# EAGLE design CrackberryPi_1.0.5_test3 (EAGLE 7.2.0)
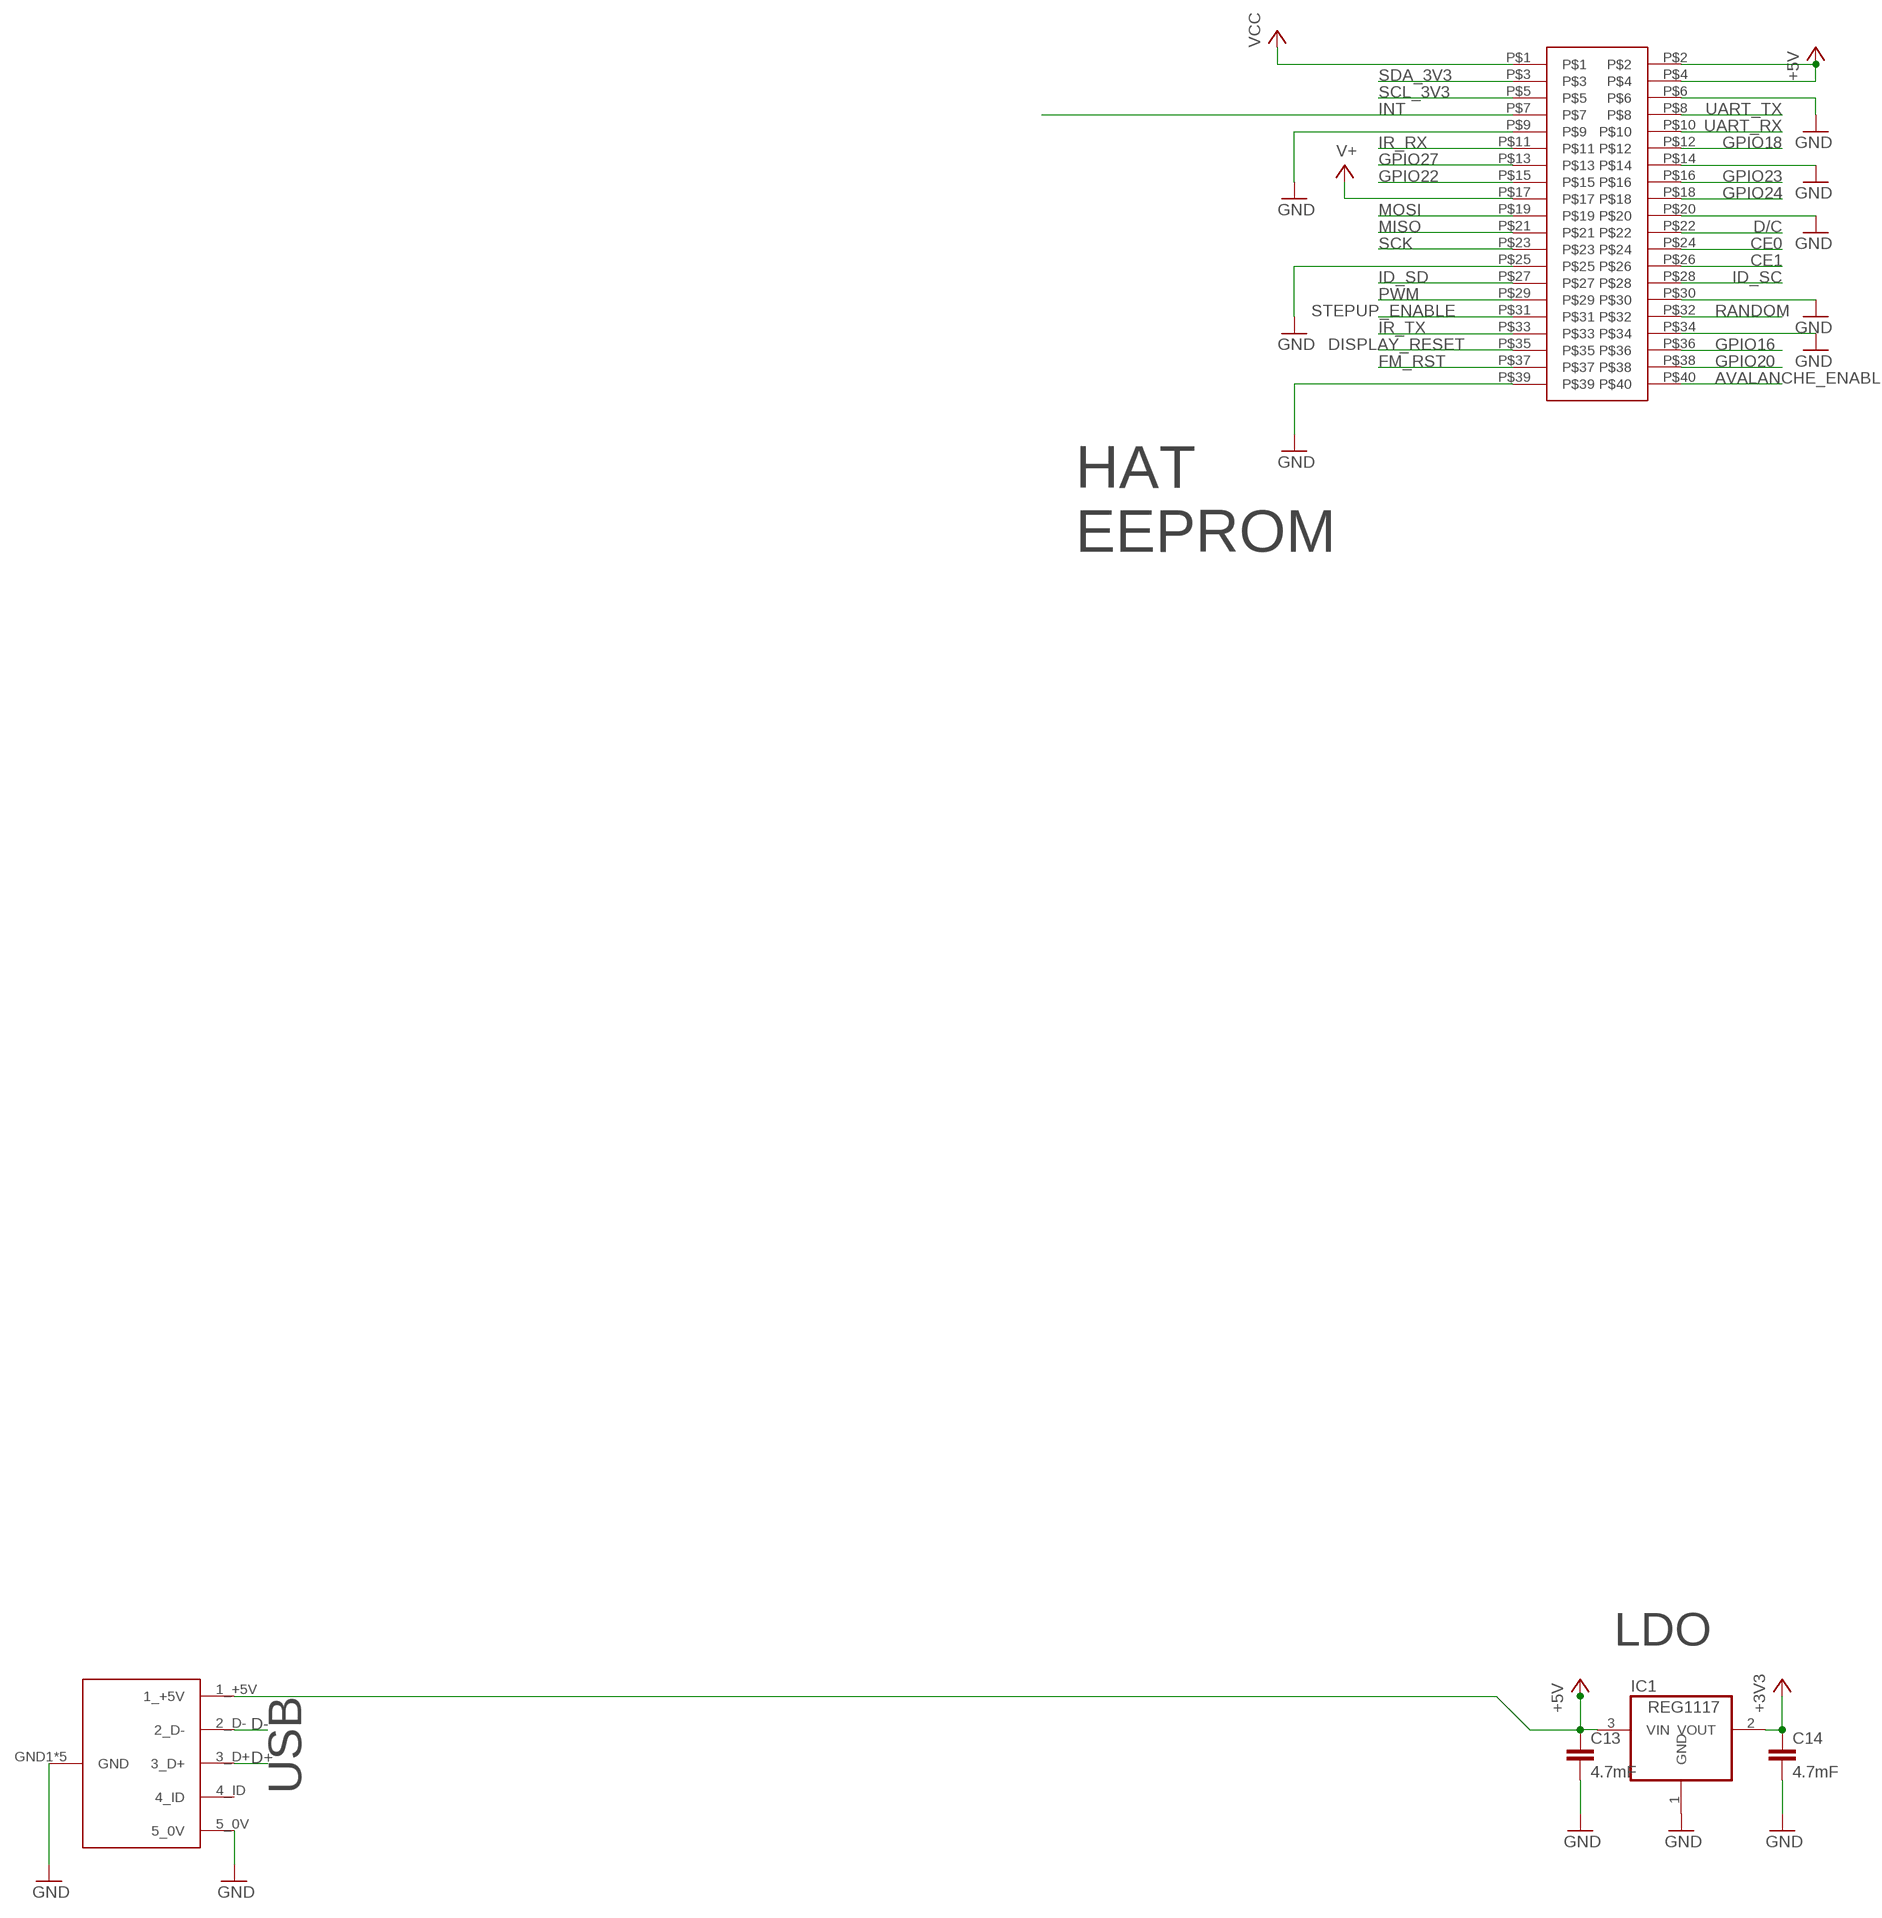
[diagram p0: schematic, sheet 1, part 1 of 2]
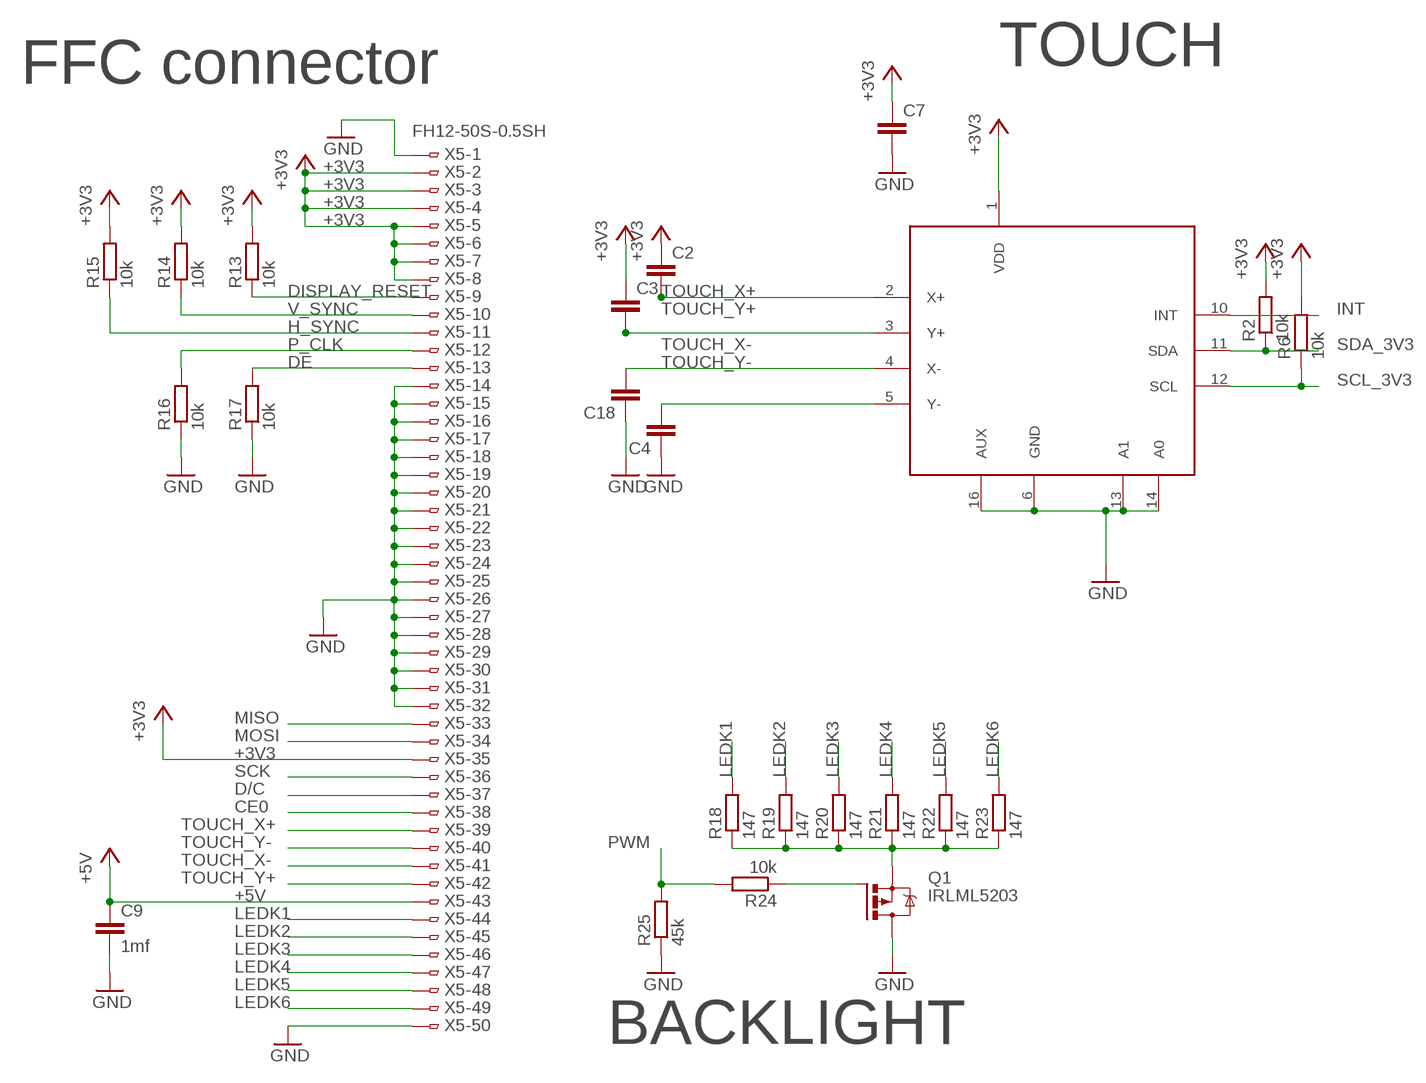
[diagram p1: schematic, sheet 1, part 2 of 2]

## Parts
C2  C-EUC0603  [C0603]
C3  C-EUC0603  [C0603]
C4  C-EUC0603  [C0603]
C7  C-EUC0603  [C0603]
C9  1mf  C-EUC0603  [C0603]
C13  4.7mF  C-EUC0603  [C0603]
C14  4.7mF  C-EUC0603  [C0603]
C18  C-EUC0603  [C0603]
IC1  REG1117  [SOT223]
Q1  IRLML5203  [MICRO3]
R2  10k  R-EU_R0603  [R0603]
R6  10k  R-EU_R0603  [R0603]
R13  10k  R-EU_R0603  [R0603]
R14  10k  R-EU_R0603  [R0603]
R15  10k  R-EU_R0603  [R0603]
R16  10k  R-EU_R0603  [R0603]
R17  10k  R-EU_R0603  [R0603]
R18  147  R-EU_R0603  [R0603]
R19  147  R-EU_R0603  [R0603]
R20  147  R-EU_R0603  [R0603]
R21  147  R-EU_R0603  [R0603]
R22  147  R-EU_R0603  [R0603]
R23  147  R-EU_R0603  [R0603]
R24  10k  R-EU_R0603  [R0603]
R25  45k  R-EU_R0603  [R0603]
U$6  TSC2007  [TSSOP16]
U$9  MICRO_USB  [MICRO_USB]
U$11  HEADER  [20X2]
X5  FH12-50S-0.5SH  [FH12-50S-0.5SH]

## Nets
+3V3: C2.1 C3.1 C7.1 C14.1 IC1.2(VOUT) R2.2 R6.2 R13.2 R14.2 R15.2 U$6.1(VDD) X5.2 X5.3 X5.4 X5.5 X5.6 X5.7 X5.8 X5.35
+5V: C9.1 C13.1 IC1.3(VIN) U$9.1_+5V U$11.P$2 U$11.P$4 X5.43
AVALANCHE_ENABLE: U$11.P$40
CE0: U$11.P$24 X5.38
CE1: U$11.P$26
D+: U$9.3_D+
D-: U$9.2_D-
D/C: U$11.P$22 X5.37
DE: R17.2 X5.13
DISPLAY_RESET: R13.1 U$11.P$35 X5.9
FM_RST: U$11.P$37
GND: C4.1 C7.2 C9.2 C13.2 C14.2 C18.1 IC1.1(GND) Q1.3(D) R16.1 R17.1 R25.1 U$6.6(GND) U$6.13(A1) U$6.14(A0) U$6.16(AUX) U$9.5_0V U$9.GND1(GND) U$9.GND2(GND) U$9.GND5(GND) U$9.P$1(GND) U$9.P$7(GND) U$11.P$6 U$11.P$9 U$11.P$14 U$11.P$20 U$11.P$25 U$11.P$30 U$11.P$34 U$11.P$39 X5.1 X5.14 X5.15 X5.16 X5.17 X5.18 X5.19 X5.20 X5.21 X5.22 X5.23 X5.24 X5.25 X5.26 X5.27 X5.28 X5.29 X5.30 X5.31 X5.32 X5.50
GPIO16: U$11.P$36
GPIO18: U$11.P$12
GPIO20: U$11.P$38
GPIO22: U$11.P$15
GPIO23: U$11.P$16
GPIO24: U$11.P$18
GPIO27: U$11.P$13
H_SYNC: R15.1 X5.11
ID_SC: U$11.P$28
ID_SD: U$11.P$27
INT: U$6.10(INT) U$11.P$7
IR_RX: U$11.P$11
IR_TX: U$11.P$33
LEDK1: R18.2 X5.44
LEDK2: R19.2 X5.45
LEDK3: R20.2 X5.46
LEDK4: R21.2 X5.47
LEDK5: R22.2 X5.48
LEDK6: R23.2 X5.49
MISO: U$11.P$21 X5.33
MOSI: U$11.P$19 X5.34
N$12: Q1.2(S) R18.1 R19.1 R20.1 R21.1 R22.1 R23.1
N$20: Q1.1(G) R24.1
P_CLK: R16.2 X5.12
PWM: R24.2 R25.2 U$11.P$29
RANDOM: U$11.P$32
SCK: U$11.P$23 X5.36
SCL_3V3: R6.1 U$6.12(SCL) U$11.P$5
SDA_3V3: R2.1 U$6.11(SDA) U$11.P$3
STEPUP_ENABLE: U$11.P$31
TOUCH_X+: C2.2 U$6.2(X+) X5.39
TOUCH_X-: C18.2 U$6.4(X-) X5.41
TOUCH_Y+: C3.2 U$6.3(Y+) X5.42
TOUCH_Y-: C4.2 U$6.5(Y-) X5.40
UART_RX: U$11.P$10
UART_TX: U$11.P$8
V+: U$11.P$17
V_SYNC: R14.1 X5.10
VCC: U$11.P$1
Unconnected: U$9.4_ID

## Notes on the sheet
- FFC connector | TOUCH
- HAT
  EEPROM
- BACKLIGHT
- LDO
- USB

## Library data of the parts
C2-C4 C7 C9 C13 C14 C18 = rcl:C-EU: CAPACITOR, European symbol
IC1 = burr-brown:REG1117: 800mA and 1A Low Dropout (LDO) Positive Regulator 1.8V, 2.5V, 2.85V, 3.3V, 5V, and Adj; MPN: REG1117; OC_FARNELL: 1097566; OC_NEWARK: 14P6981
Q1 = transistor-power:IRLML5203: HEXFET P-Channel Power MOSFET
R2 R6 R13-R25 = rcl:R-EU_: RESISTOR, European symbol
U$6 = tsc2046:TSC2007
U$9 = MICRO_USB:MICRO_USB
U$11 = 20x2_cirqoid:HEADER
X5 = FCI_62684:FH12-50S-0.5S: 0.5mm Pitch Connectors For FPC/FFC Source: Data sheet <http://www.hirose.co.jp/cataloge_hp/e58605370.pdf>; MPN: FH12-50S-0.5SH(55); OC_FARNELL: 1324557; OC_NEWARK: 34M6181

## Board
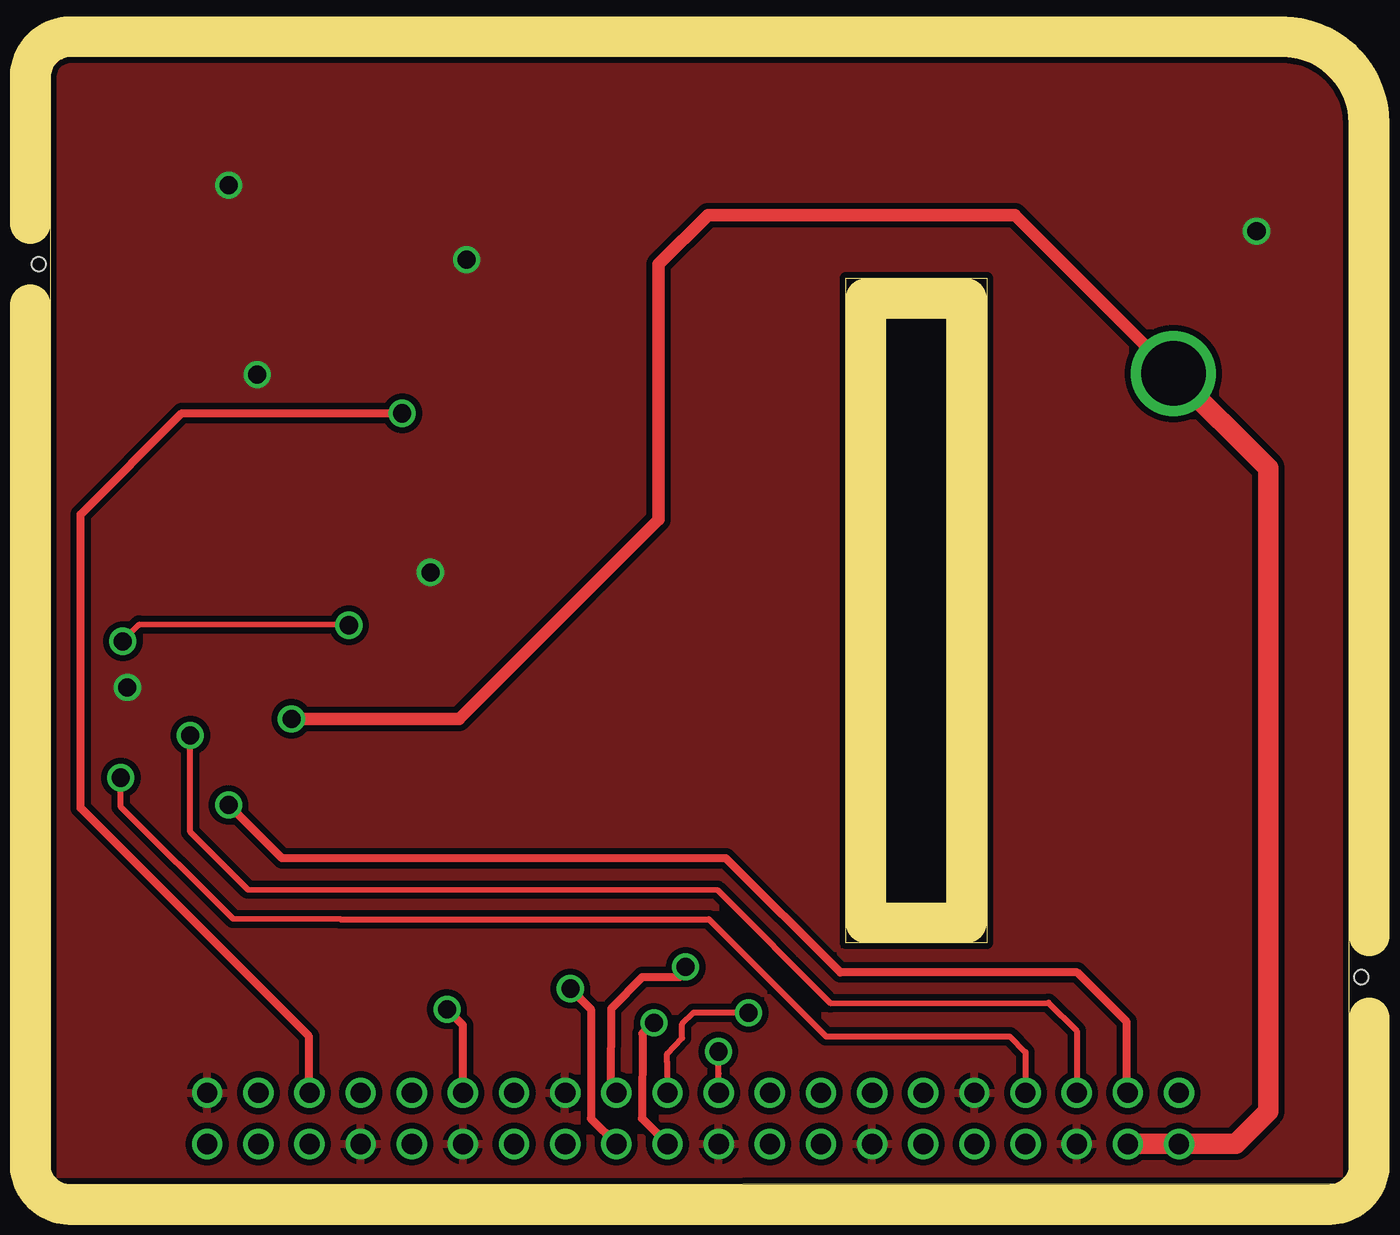
[diagram p2: board, top side]
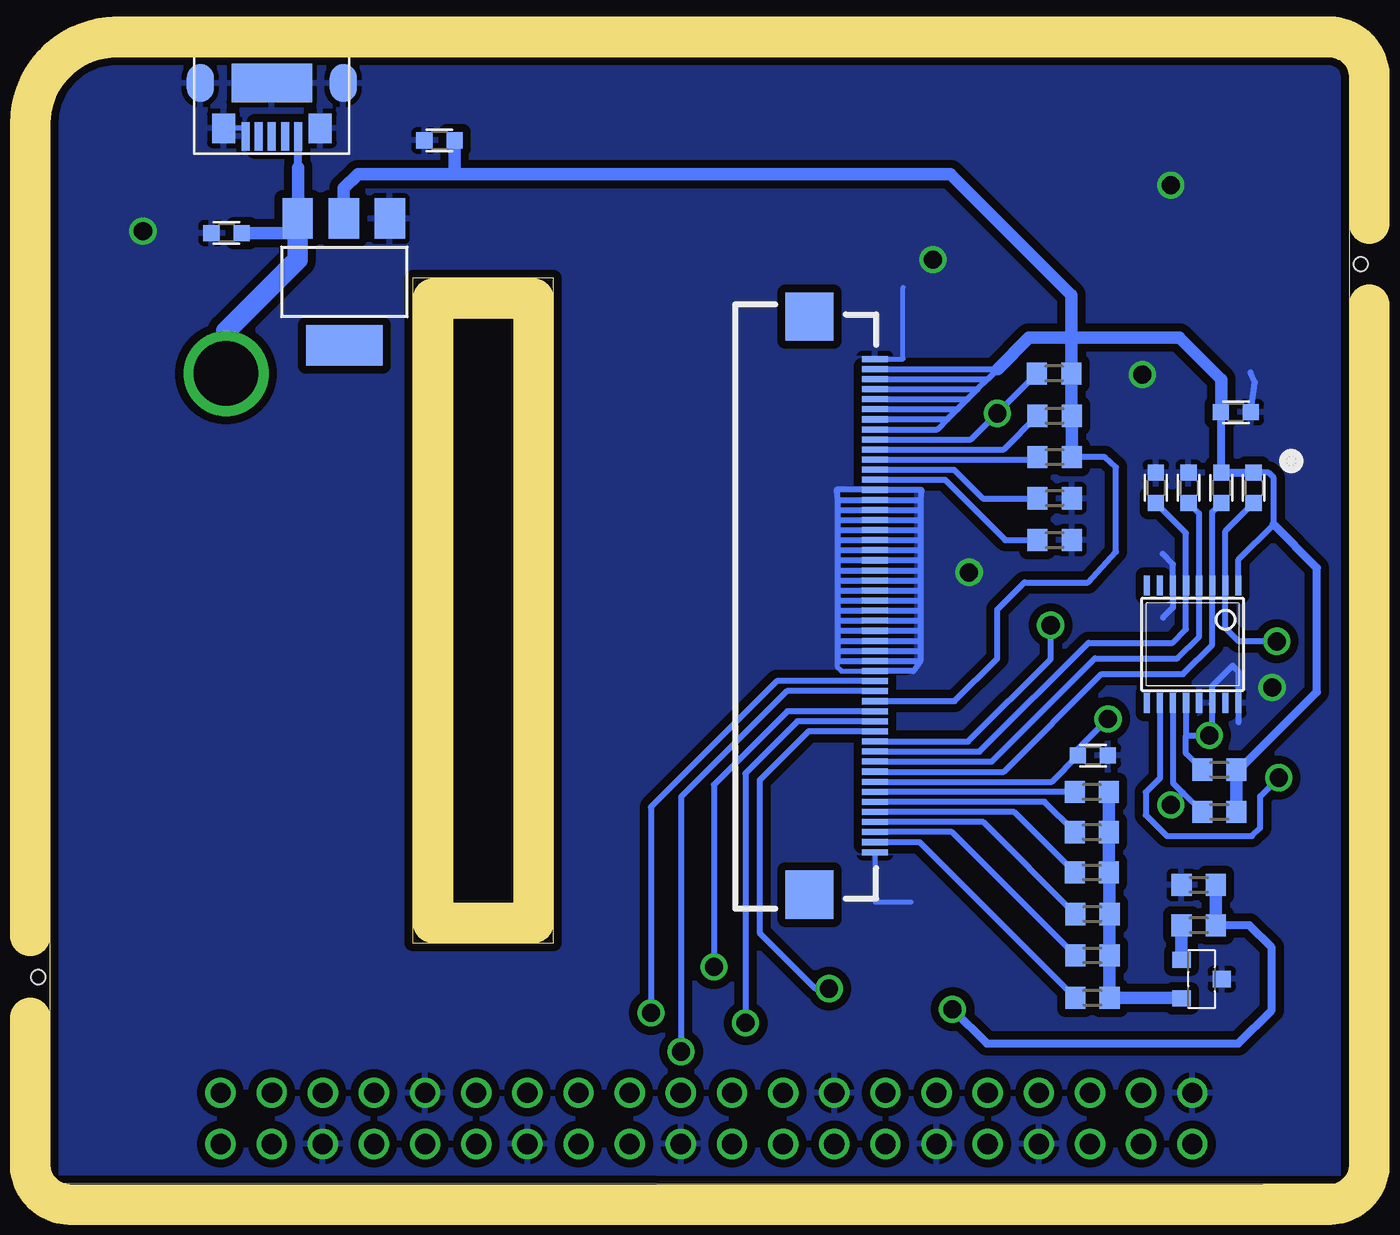
[diagram p3: board, bottom side, seen from below]

Size 64.5 x 56 mm. Coordinates in mm from the lower left corner, seen from the top.
Outline: 0,0 4.28,0 64.5,0.05 64.5,52.7 arc90 61.2,56 1,56 arc90 0,55 0,0
Outline: 39.5,45 46.5,45 46.5,12 39.5,12 39.5,45
Copper layers (1*16): Top 0.035mm / dielectric 1.5mm / Bottom 0.035mm
Design rules "SeeedStudio_2layer_DRU_no_angle_20140221": minimum track width 6mil, minimum drill 12mil, track to track 6mil, track to pad 6mil, pad to pad 6mil, via to via 6mil, smd to smd 0mil, copper to edge 10mil, drill to drill 10mil, minimum pad ring 10mil, minimum via ring 6mil, stop-mask expansion 2mil, vias tented up to drill 100mil, thermal gap 10mil
Holes 0.7 mm at -0.57,45.7 65.1,10.3
bRestrict: area 22,33.2 to 24.9,33.3; area 22,32.7 to 24.9,32.8; area 22,32.2 to 24.9,32.3; area 22,31.7 to 24.9,31.8; area 22,31.2 to 24.9,31.3; area 22,30.7 to 24.9,30.8; area 22,30.2 to 24.9,30.3; area 22,29.7 to 24.9,29.8; area 22,29.2 to 24.9,29.3; area 22,28.7 to 24.9,28.8; area 22,28.2 to 24.9,28.3; area 22,27.7 to 24.9,27.8; 6 more areas
Milling: 15 lines

### Footprints (pad centres in the part's own frame; a part is rotated, then mirrored left to right if it is on the bottom)
C0603 = smd 0.8 x 0.8: 1 -0.75,0; 2 0.75,0
SOT223 = smd 1.499 x 2.007: 1 -2.261,-3.15; 2 0.025,-3.15; 3 2.311,-3.15 | smd 3.81 x 2.007: 4 0,3.15
MICRO3 = smd 0.8 x 0.9: 1 -0.95,-1; 2 0.95,-1; 3 0,1
R0603 = smd 1 x 1.1: 1 -0.85,0; 2 0.85,0
TSSOP16 = smd 0.305 x 0.991: 1 -2.275,-2.918; 2 -1.625,-2.918; 3 -0.975,-2.918; 4 -0.325,-2.918; 5 0.325,-2.918; 6 0.975,-2.918; 7 1.625,-2.918; 8 2.275,-2.918; 9 2.275,2.918; 10 1.625,2.918; 11 0.975,2.918; 12 0.325,2.918; 13 -0.325,2.918; 14 -0.975,2.918; 15 -1.625,2.918; 16 -2.275,2.918
MICRO_USB = smd 0.4 x 1.4: 1_+5V -1.3,2.65; 2_D- -0.65,2.65; 3_D+ 0,2.65; 4_ID 0.65,2.65; 5_0V 1.3,2.65 | smd 4 x 1.9: GND1 0,0 | smd 1.35 x 1.9: GND2 -3.55,0; GND5 3.55,0 | smd 1.15 x 1.45: P$1 -2.4,2.25; P$7 2.4,2.25
20X2 = drill 1: P$1 0,0; P$2 0,2.54; P$3 2.54,0; P$4 2.54,2.54; P$5 5.08,0; P$6 5.08,2.54; P$7 7.62,0; P$8 7.62,2.54; P$9 10.16,0; P$10 10.16,2.54; P$11 12.7,0; P$12 12.7,2.54; P$13 15.24,0; P$14 15.24,2.54; P$15 17.78,0; P$16 17.78,2.54; P$17 20.32,0; P$18 20.32,2.54; P$19 22.86,0; P$20 22.86,2.54; P$21 25.4,0; P$22 25.4,2.54; P$23 27.94,0; P$24 27.94,2.54; P$25 30.48,0; P$26 30.48,2.54; P$27 33.02,0; P$28 33.02,2.54; P$29 35.56,0; P$30 35.56,2.54; P$31 38.1,0; P$32 38.1,2.54; P$33 40.64,0; P$34 40.64,2.54; P$35 43.18,0; P$36 43.18,2.54; P$37 45.72,0; P$38 45.72,2.54; P$39 48.26,0; P$40 48.26,2.54
FH12-50S-0.5SH = smd 1.3 x 0.3: 1 3.95,27.8; 2 3.95,27.3; 3 3.95,26.8; 4 3.95,26.3; 5 3.95,25.8; 6 3.95,25.3; 7 3.95,24.8; 8 3.95,24.3; 9 3.95,23.8; 10 3.95,23.3; 11 3.95,22.8; 12 3.95,22.3; 13 3.95,21.8; 14 3.95,21.3; 15 3.95,20.8; 16 3.95,20.3; 17 3.95,19.8; 18 3.95,19.3; 19 3.95,18.8; 20 3.95,18.3; 21 3.95,17.8; 22 3.95,17.3; 23 3.95,16.8; 24 3.95,16.3; 25 3.95,15.8; 26 3.95,15.3; 27 3.95,14.8; 28 3.95,14.3; 29 3.95,13.8; 30 3.95,13.3; 31 3.95,12.8; 32 3.95,12.3; 33 3.95,11.8; 34 3.95,11.3; 35 3.95,10.8; 36 3.95,10.3; 37 3.95,9.8; 38 3.95,9.3; 39 3.95,8.8; 40 3.95,8.3; 41 3.95,7.8; 42 3.95,7.3; 43 3.95,6.8; 44 3.95,6.3; 45 3.95,5.8; 46 3.95,5.3; 47 3.95,4.8; 48 3.95,4.3; 49 3.95,3.8; 50 3.95,3.3 | smd 2.4 x 2.4: P$1 0.7,1.2; P$2 0.7,29.9

### Placement (x,y rotation side)
C2  4.75,34.6 270 bottom
C3  6.35,34.6 270 bottom
C4  9.6,34.6 270 bottom
C7  5.62,38.35 0 bottom
C9  12.72,21.3 0 bottom
C13  55.75,47.25 180 bottom
C14  45.17,51.85 180 bottom
C18  7.97,34.6 270 bottom
IC1  49.9,44.83 180 bottom
Q1  7.33,10.2 270 bottom
R2  6.45,18.5 0 bottom
R6  6.45,20.6 0 bottom
R13  14.65,40.27 0 bottom
R14  14.62,38.17 0 bottom
R15  14.62,36.12 0 bottom
R16  14.62,34.08 180 bottom
R17  14.62,32 180 bottom
R18  12.78,19.5 180 bottom
R19  12.78,17.5 180 bottom
R20  12.78,15.5 180 bottom
R21  12.75,13.43 180 bottom
R22  12.75,11.38 180 bottom
R23  12.75,9.28 180 bottom
R24  7.47,12.88 0 bottom
R25  7.47,14.88 0 bottom
U$6  7.78,26.82 180 bottom
U$9  53.5,54.7 180 bottom
U$11  56.05,4.55 180 top
X5  27.5,13.2 0 bottom

### Tracks (layer width: path | path; a pad name or v marks a point on that pad's centre or on a via)
+3V3
  Bottom 0.254: 19.45,38.5 18.95,39
  Bottom 0.305: X5.8 20.45,37.5 19.95,38 | X5.7 19.95,38 | 19.95,38 18.95,39 | X5.6 19.45,38.5 19.43,38.52 | X5.5 18.95,39 | 18.95,39 18.45,39.5 | X5.4 18.45,39.5 | 18.45,39.5 17.95,40 | X5.3 17.95,40 | 17.95,40 17.45,40.5 X5.2 | U$6.1 5.5,31.02 3.75,32.77 3.75,35.1 4,35.35 C2.1 | X5.35 19.6,24 17.48,26.12 17.48,28.55 16.12,29.9 12.97,29.9 11.57,31.43 11.57,35.62 12.12,36.12 R15.2
  Bottom 0.406: C2.1 C3.1 6.35,38.17 C7.1 | R6.2 5.45,20.6 1.6,24.45 1.6,30.62 3.75,32.77
  Bottom 0.61: R15.2 R14.2 13.8,38.2 R13.2 13.8,42.05 | 13.8,42.05 15.9,42.05 17.45,40.5 | IC1.2 49.92,49.48 49.23,50.17 44.42,50.17 | 44.42,50.17 19.8,50.17 13.8,44.17 13.8,42.05 | C14.1 44.42,50.17 | R2.2 R6.2 | 6.35,38.17 6.35,39.98 8.43,42.05 13.8,42.05
+5V  (via drill 0.9, 3.2)
  Top 0.61: v11.97,23.12 20.3,23.12 30.2,33.02 30.2,45.7 32.65,48.15 47.9,48.15 v55.77,40.27
  Top 1.016: U$11.P$2 U$11.P$4 58.86,2.01 60.48,3.62 60.48,35.58 v55.77,40.27
  Bottom 0.254: U$11.P$2 56.05,2.05
  Bottom 0.305: X5.43 14.78,20 C9.1 13.47,21.62 v11.97,23.12
  Bottom 0.406: 52.2,50.5 U$9.1_+5V
  Bottom 0.61: 52.2,50.5 52.2,47.19 IC1.3 | C13.1 52.29,47.25 IC1.3 | 52.23,47.16 IC1.3
  Bottom 1.016: v55.77,40.27 55.77,42.38 52.23,45.92 52.23,47.96 IC1.3
CE0  (via drill 0.9)
  Top 0.406: v25.82,9.72 26.85,8.7 26.85,3.27 U$11.P$24
  Bottom 0.305: X5.38 26.85,22.5 29.27,20.07 29.27,12.5 26.5,9.72 v25.82,9.72
D/C  (via drill 0.9)
  Top 0.406: v29.98,8.03 29.4,7.5 29.38,3.29 U$11.P$22
  Bottom 0.305: X5.37 27.4,23 30,20.4 29.98,20.38 v29.98,8.03
DE
  Bottom 0.305: X5.13 20.07,35 17.07,32 R17.2
DISPLAY_RESET  (via drill 0.9)
  Top 0.406: v12.85,4.57 12.85,7.35 1.5,18.7 1.5,33.27 6.53,38.3 v17.48,38.3
  Bottom 0.254: v12.85,4.57 U$11.P$35
  Bottom 0.305: X5.9 18.77,37 v17.48,38.3 R13.1
FM_RST
  Bottom 0.254: 10.3,4.58 U$11.P$37
GND  (via drill 0.9)
  Bottom 0.254: 23.5,25.5 25.23,25.5 25.4,25.68 25.4,26 | U$9.5_0V 54.8,52.45 U$9.P$7 | X5.1 22.15,41 22.15,44.55 | X5.50 23.55,14.03 21.75,14.03
  Bottom 0.305: 21.3,34 21.25,34.5 X5.14 25.45,34.5 25.4,34 | 21.3,34 21.3,33.5 | 21.3,33.5 21.3,33 | 21.3,33 21.3,32.5 | 21.3,32.5 21.3,32 | 21.3,32 21.3,31.5 | 21.3,31.5 21.3,31 | 21.3,31 21.3,30.5 | 21.3,30.5 21.3,30 | 21.3,30 21.3,29.5 | 21.3,28.5 21.3,28 | 21.3,28 21.3,27.5 | 21.3,27.5 21.3,27 | 21.3,27 21.3,26.5 | 21.3,26.5 21.3,26 | 21.3,26 21.65,25.5 23.5,25.5 X5.32 | 21.3,26 X5.31 25.4,26 25.4,26.5 | 21.3,26.5 X5.30 25.4,26.5 | 21.3,27 X5.29 25.4,27 | 21.3,27.5 X5.28 25.4,27.5 | 21.3,28 X5.27 25.4,28 | 21.3,28.5 X5.26 25.4,28.5 | 21.3,29.5 X5.24 25.4,29.5 | 21.3,29.5 21.3,29 | 21.3,29 X5.25 25.4,29 | 21.3,29 21.3,28.5 | 21.3,30 X5.23 25.4,30 | 21.3,30.5 X5.22 25.4,30.5 | 21.3,31 X5.21 25.4,31 | 21.3,31.5 X5.20 25.4,31.5 | 21.3,32 X5.19 25.4,32 | 21.3,32.5 X5.18 25.4,32.5 | 21.3,33 X5.17 25.4,33 | 21.3,34 X5.15 25.4,34 | 21.3,33.5 X5.16 25.4,33.5 | 25.4,34 25.4,33.5 | 25.4,33.5 25.4,33 | 25.4,33 25.4,32.5 | 25.4,32.5 25.4,32 | 25.4,32 25.4,31.5 | 25.4,31.5 25.4,31 | 25.4,31 25.4,30.5 | 25.4,30.5 25.4,30 | 25.4,30 25.4,29.5 | 25.4,29.5 25.4,29 | 25.4,29 25.4,28.5 | 25.4,28.5 25.4,28 | 25.4,28 25.4,27.5 | 25.4,27.5 25.4,27 | 25.4,27 25.4,26.5 | 6.83,22.93 6.83,23.88 U$6.14 6.8,24.75 5.8,25.75 5.78,25.75 5.5,25.48 U$6.16 5.5,22.95 | C7.2 4.67,39.83 4.9,40.33 | 9.25,28.15 8.75,28.65 U$6.6 8.75,30.8 9.28,31.32
  Bottom 0.61: 55.88,52.42 U$9.P$7
  other vias: 18.88,30.4 20.68,45.92 8.85,49.62 59.9,47.35 3.83,24.68 10.28,40.23
  pour Bottom (isolate 0.406, rank 6): 0.05,0.07 3.4,-0.05 3.52,-0.1 64.55,-0.05 64.42,52.7 arc90 61.1,56 0.91,56.2 arc90 0.05,55.11
  pour Top (isolate 0.305, rank 6): 0,0 3.48,-0.12 3.42,-0.17 64.45,-0.05 64.5,52.6 arc90 61.1,56 1,56 arc90 0,55
GPIO23
  Top 0.254: 38.27,2.05 U$11.P$16
GPIO24
  Top 0.254: 35.73,2.05 U$11.P$18
H_SYNC
  Bottom 0.305: X5.11 15.6,36 R15.1
INT  (via drill 0.9)
  Top 0.305: U$11.P$7 48.43,6.57 47.65,7.35 38.52,7.35 32.7,13.18 14.4,13.18 9.07,13.2 3.5,18.75 v3.5,20.2
  Bottom 0.254: 48.45,4.57 U$11.P$7
  Bottom 0.305: U$6.10 9.4,20.18 10.1,19.48 10.1,18.35 9.05,17.3 4.83,17.3 4.42,17.7 4.42,19.27 v3.5,20.2
LEDK1
  Bottom 0.305: 13.62,19.25 R18.2 X5.44
LEDK2
  Bottom 0.305: R19.2 15.12,19 X5.45
LEDK3
  Bottom 0.305: R20.2 16.62,18.5 X5.46
LEDK4
  Bottom 0.305: R21.2 18.18,18 X5.47
LEDK5
  Bottom 0.305: R22.2 19.73,17.5 X5.48
LEDK6
  Bottom 0.305: R23.2 21.32,17 X5.49
MISO  (via drill 0.9)
  Top 0.305: v34.67,8.53 31.95,8.53 31.38,7.97 31.38,7.28 30.62,6.5 30.62,6.08 U$11.P$21
  Bottom 0.305: X5.33 28.43,25 34.67,18.75 v34.67,8.53
MOSI  (via drill 0.9)
  Top 0.305: U$11.P$19 33.19,5.51 v33.17,6.6
  Bottom 0.305: X5.34 27.93,24.5 33.17,19.25 v33.17,6.6
N$12
  Bottom 0.61: R18.1 R19.1 R20.1 11.9,15.47 R21.1 R22.1 R23.1 8.35,9.28 Q1.2
N$20
  Bottom 0.61: Q1.1 R24.1
P_CLK
  Bottom 0.305: X5.12 19.62,35.5 18.2,34.08 R16.2
PWM  (via drill 0.9)
  Top 0.406: U$11.P$29 20.49,7.91 v19.7,8.7
  Bottom 0.406: v19.7,8.7 18,7 5.5,7 3.85,8.65 3.85,11.78 4.95,12.88 R24.2
  Bottom 0.61: R25.2 R24.2
SCK  (via drill 0.9)
  Top 0.406: U$11.P$23 27.82,4.88 27.85,8.72 29.4,10.3 31.25,10.3 v31.55,10.8
  Bottom 0.305: X5.36 27.9,23.5 31.55,19.85 v31.55,10.8
SCL_3V3  (via drill 0.9)
  Top 0.305: U$11.P$5 50.97,7.63 49.58,9.03 38.75,9 33.12,14.62 9.8,14.65 6.95,17.5 v6.95,22.3
  Bottom 0.305: U$6.12 8.1,22.3 | R6.1 8.1,21.4 8.1,22.3 | 8.1,22.3 v6.95,22.3
SDA_3V3  (via drill 0.9)
  Top 0.406: v53.45,4.61 53.45,8.07 51,10.53 39.23,10.53 33.55,16.2 11.5,16.2 v8.85,18.85
  Bottom 0.305: U$6.11 8.75,19.95 8.25,19.45 | 8.25,19.45 R2.1 | 8.25,19.45 v8.85,18.85
  Bottom 0.406: v53.45,4.61 U$11.P$3
TOUCH_X+  (via drill 0.9)
  Top 0.305: v14.82,27.77 4.42,27.8 v3.6,26.98
  Bottom 0.305: X5.39 18.93,22 14.82,26.1 v14.82,27.77 | v3.6,26.98 5.47,26.98 6.15,27.62 U$6.2 6.15,32.45 C2.2
TOUCH_X-
  Bottom 0.305: X5.41 17.75,21 12.62,26.12 8.53,26.12 7.45,27.2 U$6.4 7.45,33.33 C18.2
TOUCH_Y+
  Bottom 0.305: X5.42 17.15,20.5 12.3,25.35 8.25,25.35 6.8,26.8 U$6.3 6.8,33.4 C3.2
TOUCH_Y-
  Bottom 0.305: X5.40 18.35,21.5 12.95,26.9 8.78,26.9 8.1,27.57 U$6.5 8.1,32.35 C4.2
V_SYNC
  Bottom 0.305: X5.10 17.15,36.5 R14.1